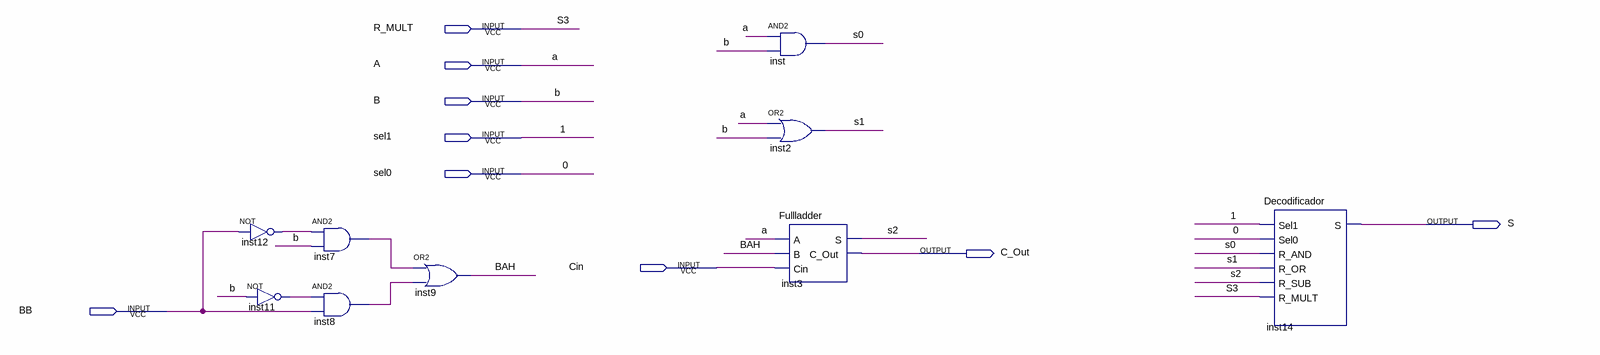
[diagram p0: schematic sheet]
// Quartus schematic 1bit.bdf as structural Verilog: 9 symbols, 9 pins
module \1bit  (
  input  R_MULT,
  input  A,
  input  B,
  input  sel1,
  input  sel0,
  input  Cin,
  input  BB,
  output S,
  output C_Out
);

  wire BAH, inst7_out, inst8_out, inst11_out, inst12_out, s0, s1, s2;

  not inst12 (inst12_out, BB);
  not inst11 (inst11_out, B);
  and inst7 (inst7_out, inst12_out, B);
  and inst8 (inst8_out, inst11_out, BB);
  or inst9 (BAH, inst7_out, inst8_out);
  and inst (s0, A, B);
  or inst2 (s1, A, B);
  Fullladder inst3 (.A(A), .B(BAH), .Cin(Cin), .S(s2), .C_Out(C_Out));
  Decodificador inst14 (.Sel1(sel1), .Sel0(sel0), .R_AND(s0), .R_OR(s1), .R_SUB(s2), .R_MULT(R_MULT), .S(S));

  // Other names for the same wires on the sheet: 0 = sel0; 1 = sel1; S3 = R_MULT
endmodule
